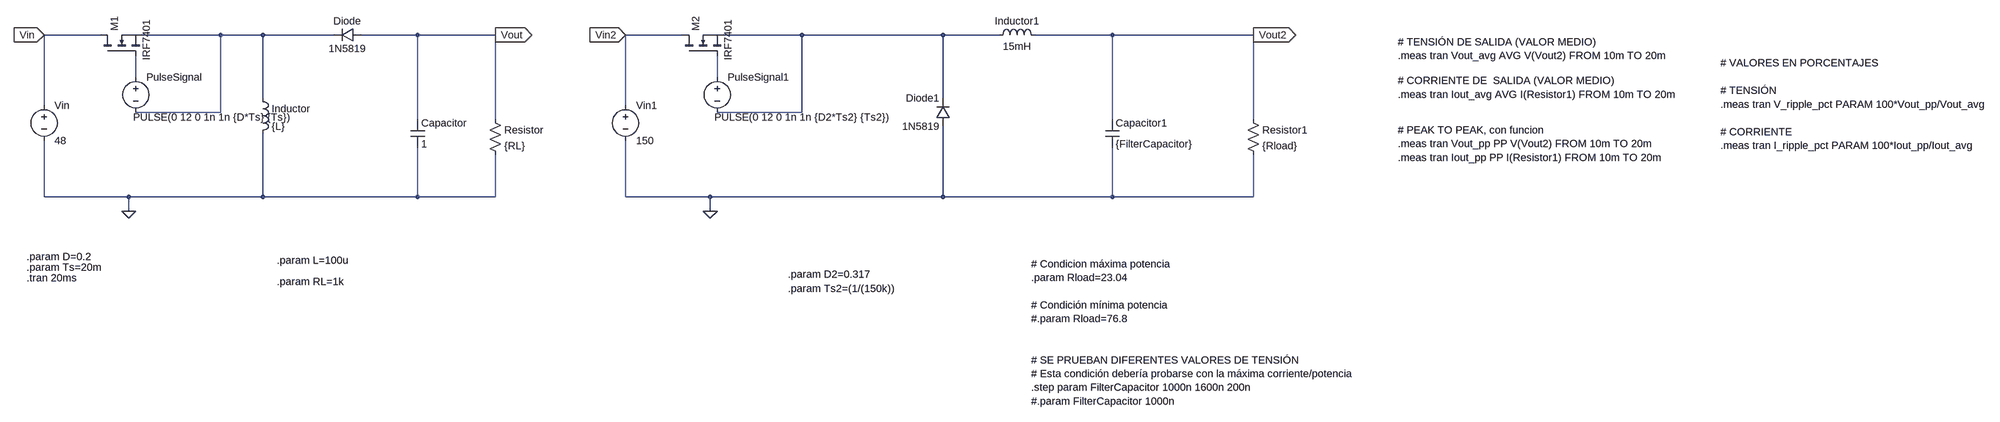
[diagram p0: schematic BuckConvertor.asc]
BuckConvertor.asc, the LTspice schematic file:
Version 4.1
SHEET 1 5084 908
WIRE 32 -80 -96 -80
WIRE 304 -80 128 -80
WIRE 400 -80 304 -80
WIRE 560 -80 400 -80
WIRE 768 -80 624 -80
WIRE 944 -80 768 -80
WIRE 1744 -80 1616 -80
WIRE 2016 -80 1840 -80
WIRE 2336 -80 2016 -80
WIRE 2544 -80 2336 -80
WIRE 2800 -80 2624 -80
WIRE 3120 -80 2800 -80
WIRE 112 16 112 -32
WIRE 1824 16 1824 -32
WIRE 400 64 400 -80
WIRE 2336 64 2336 -80
WIRE -96 80 -96 -80
WIRE 1616 80 1616 -80
WIRE 304 96 304 -80
WIRE 304 96 112 96
WIRE 2016 96 2016 -80
WIRE 2016 96 1824 96
WIRE 768 112 768 -80
WIRE 944 112 944 -80
WIRE 2800 112 2800 -80
WIRE 3120 112 3120 -80
WIRE -96 288 -96 160
WIRE 96 288 -96 288
WIRE 400 288 400 144
WIRE 400 288 96 288
WIRE 768 288 768 176
WIRE 768 288 400 288
WIRE 944 288 944 192
WIRE 944 288 768 288
WIRE 1616 288 1616 160
WIRE 1808 288 1616 288
WIRE 2336 288 2336 128
WIRE 2336 288 1808 288
WIRE 2800 288 2800 176
WIRE 2800 288 2336 288
WIRE 3120 288 3120 192
WIRE 3120 288 2800 288
WIRE 96 320 96 288
WIRE 1808 320 1808 288
FLAG 96 320 0
FLAG -96 -80 Vin
IOPIN -96 -80 In
FLAG 944 -80 Vout
IOPIN 944 -80 Out
FLAG 1808 320 0
FLAG 1616 -80 Vin2
IOPIN 1616 -80 In
FLAG 3120 -80 Vout2
IOPIN 3120 -80 Out
SYMBOL ind 384 48 R0
SYMATTR InstName Inductor
SYMATTR Value {L}
SYMATTR SpiceLine Rser=50m
SYMBOL cap 752 112 R0
SYMATTR InstName Capacitor
SYMATTR Value 1
SYMATTR SpiceLine Rser=5m
SYMBOL res 928 96 R0
SYMATTR InstName Resistor
SYMATTR Value {RL}
SYMBOL voltage 112 0 R0
WINDOW 3 -6 107 Left 2
WINDOW 123 0 0 Left 0
WINDOW 39 0 0 Left 0
SYMATTR Value PULSE(0 12 0 1n 1n {D*Ts} {Ts})
SYMATTR InstName PulseSignal
SYMBOL diode 624 -96 R90
WINDOW 0 0 32 VBottom 2
WINDOW 3 32 32 VTop 2
SYMATTR InstName Diode
SYMATTR Value 1N5819
SYMBOL voltage -96 64 R0
WINDOW 123 0 0 Left 0
WINDOW 39 0 0 Left 0
SYMATTR InstName Vin
SYMATTR Value 48
SYMBOL nmos 32 -32 R270
WINDOW 3 -10 105 Left 2
SYMATTR Value IRF7401
SYMATTR InstName M1
SYMBOL ind 2528 -64 R270
WINDOW 0 32 56 VTop 2
WINDOW 3 5 56 VBottom 2
SYMATTR InstName Inductor1
SYMATTR Value 15mH
SYMATTR SpiceLine Rser=50m
SYMBOL cap 2784 112 R0
SYMATTR InstName Capacitor1
SYMATTR Value {FilterCapacitor}
SYMATTR SpiceLine Rser=5m
SYMBOL res 3104 96 R0
SYMATTR InstName Resistor1
SYMATTR Value {Rload}
SYMBOL voltage 1824 0 R0
WINDOW 3 -6 107 Left 2
WINDOW 123 0 0 Left 0
WINDOW 39 0 0 Left 0
SYMATTR Value PULSE(0 12 0 1n 1n {D2*Ts2} {Ts2})
SYMATTR InstName PulseSignal1
SYMBOL diode 2352 128 R180
WINDOW 0 24 64 Left 2
WINDOW 3 24 0 Left 2
SYMATTR InstName Diode1
SYMATTR Value 1N5819
SYMBOL voltage 1616 64 R0
WINDOW 123 0 0 Left 0
WINDOW 39 0 0 Left 0
SYMATTR InstName Vin1
SYMATTR Value 150
SYMBOL nmos 1744 -32 R270
WINDOW 3 -10 105 Left 2
SYMATTR Value IRF7401
SYMATTR InstName M2
TEXT -136 424 Left 2 !.param D=0.2
TEXT -136 448 Left 2 !.param Ts=20m
TEXT -136 472 Left 2 !.tran 20ms
TEXT 432 432 Left 2 !.param L=100u
TEXT 432 480 Left 2 !.param RL=1k
TEXT 1984 464 Left 2 !.param D2=0.317
TEXT 1984 496 Left 2 !.param Ts2=(1/(150k))
TEXT 3528 -64 Left 2 !# TENSIÓN DE SALIDA (VALOR MEDIO)\n.meas tran Vout_avg AVG V(Vout2) FROM 10m TO 20m
TEXT 3528 24 Left 2 !# CORRIENTE DE  SALIDA (VALOR MEDIO)\n.meas tran Iout_avg AVG I(Resistor1) FROM 10m TO 20m
TEXT 3528 136 Left 2 !# PEAK TO PEAK, con funcion\n.meas tran Vout_pp PP V(Vout2) FROM 10m TO 20m\n.meas tran Iout_pp PP I(Resistor1) FROM 10m TO 20m
TEXT 4424 -16 Left 2 !# VALORES EN PORCENTAJES\n \n# TENSIÓN\n.meas tran V_ripple_pct PARAM 100*Vout_pp/Vout_avg\n \n# CORRIENTE\n.meas tran I_ripple_pct PARAM 100*Iout_pp/Iout_avg
TEXT 2616 440 Left 2 !# Condicion máxima potencia\n.param Rload=23.04\n \n# Condición mínima potencia\n#.param Rload=76.8\n \n \n# SE PRUEBAN DIFERENTES VALORES DE TENSIÓN\n# Esta condición debería probarse con la máxima corriente/potencia\n.step param FilterCapacitor 1000n 1600n 200n\n#.param FilterCapacitor 1000n

The netlist it stands for:
* BuckConvertor.asc
L§Inductor N001 0 {L} Rser=50m
Capacitor Vout 0 1 Rser=5m
Resistor Vout 0 {RL}
V§PulseSignal N003 N001 PULSE(0 12 0 1n 1n {D*Ts} {Ts})
Diode Vout N001 1N5819
Vin Vin 0 48
M1 Vin N003 N001 N001 IRF7401
L§Inductor1 N002 Vout2 15mH Rser=50m
Capacitor1 Vout2 0 {FilterCapacitor} Rser=5m
Resistor1 Vout2 0 {Rload}
V§PulseSignal1 N004 N002 PULSE(0 12 0 1n 1n {D2*Ts2} {Ts2})
Diode1 0 N002 1N5819
Vin1 Vin2 0 150
M2 Vin2 N004 N002 N002 IRF7401
.model D D
.lib standard.dio
.model NMOS NMOS
.model PMOS PMOS
.lib standard.mos
.param D=0.2
.param Ts=20m
.tran 20ms
.param L=100u
.param RL=1k
.param D2=0.317
.param Ts2=(1/(150k))
# TENSIÓN DE SALIDA (VALOR MEDIO)
.meas tran Vout_avg AVG V(Vout2) FROM 10m TO 20m
# CORRIENTE DE  SALIDA (VALOR MEDIO)
.meas tran Iout_avg AVG I(Resistor1) FROM 10m TO 20m
# PEAK TO PEAK, con funcion
.meas tran Vout_pp PP V(Vout2) FROM 10m TO 20m
.meas tran Iout_pp PP I(Resistor1) FROM 10m TO 20m
# VALORES EN PORCENTAJES
# TENSIÓN
.meas tran V_ripple_pct PARAM 100*Vout_pp/Vout_avg
# CORRIENTE
.meas tran I_ripple_pct PARAM 100*Iout_pp/Iout_avg
# Condicion máxima potencia
.param Rload=23.04
# Condición mínima potencia
#.param Rload=76.8
# SE PRUEBAN DIFERENTES VALORES DE TENSIÓN
# Esta condición debería probarse con la máxima corriente/potencia
.step param FilterCapacitor 1000n 1600n 200n
#.param FilterCapacitor 1000n
.backanno
.end